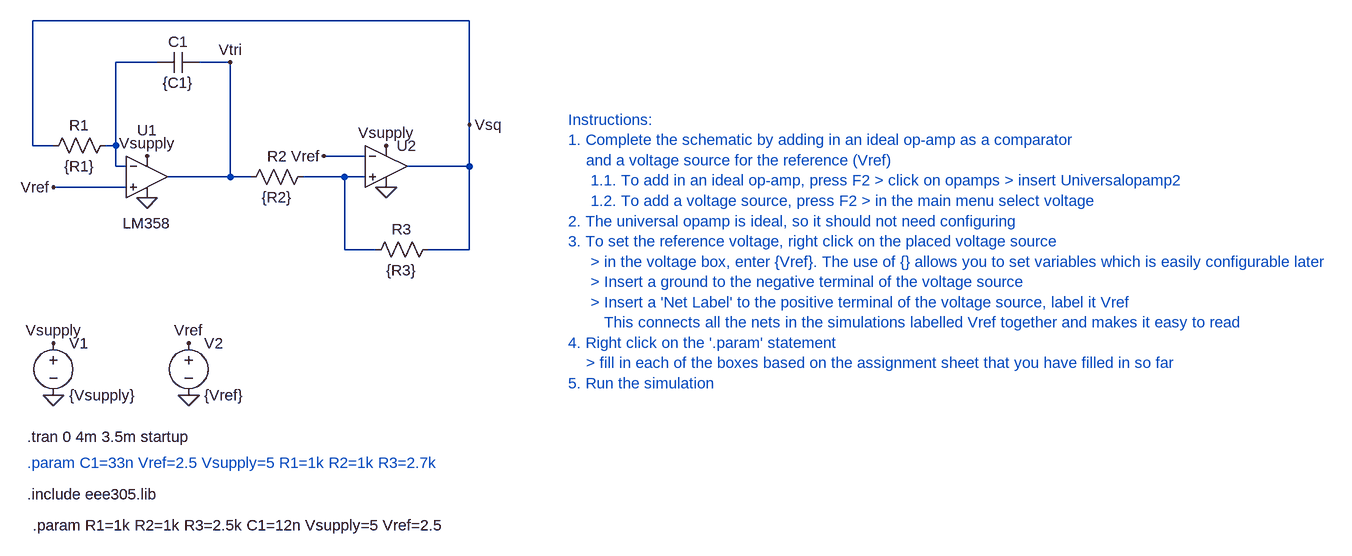
[diagram p0: schematic Assignment1_Task2_2.asc]
* Assignment1_Task2_2.asc
V1 Vsupply 0 {Vsupply}
R1 N001 Vsq {R1}
C1 Vtri N001 {C1} Rser=10m
R2 N002 Vtri {R2}
R3 Vsq N002 {R3}
XU2 N002 Vref Vsupply 0 Vsq level2 Avol=1Meg GBW=10Meg Slew=10000Meg Ilimit=25m Rail=0 Vos=0 En=0 Enk=0 In=0 Ink=0 Rin=500Meg  ; pins In+ In- V+ V- OUT
V2 Vref 0 {Vref}
* U1: LM358 (symbol AutoGenerated\LM358 not available, pins judged from their places): In+=Vref In-=N001 V+=Vsupply V-=0 OUT=Vtri
.tran 0 4m 3.5m startup
* .param C1=33n Vref=2.5 Vsupply=5 R1=1k R2=1k R3=2.7k
* Instructions:
* 1. Complete the schematic by adding in an ideal op-amp as a comparator
*     and a voltage source for the reference (Vref)
*      1.1. To add in an ideal op-amp, press F2 > click on opamps > insert Universalopamp2
*      1.2. To add a voltage source, press F2 > in the main menu select voltage
* 2. The universal opamp is ideal, so it should not need configuring
* 3. To set the reference voltage, right click on the placed voltage source
*      > in the voltage box, enter {Vref}. The use of {} allows you to set variables which is easily configurable later
*      > Insert a ground to the negative terminal of the voltage source
*      > Insert a 'Net Label' to the positive terminal of the voltage source, label it Vref
*         This connects all the nets in the simulations labelled Vref together and makes it easy to read
* 4. Right click on the '.param' statement
*     > fill in each of the boxes based on the assignment sheet that you have filled in so far
* 5. Run the simulation
.include eee305.lib
.param R1=1k R2=1k R3=2.5k C1=12n Vsupply=5 Vref=2.5
.lib UniversalOpAmp2.lib
.backanno
.end

* Results of the author's LTspice run, read from the files saved beside the schematic
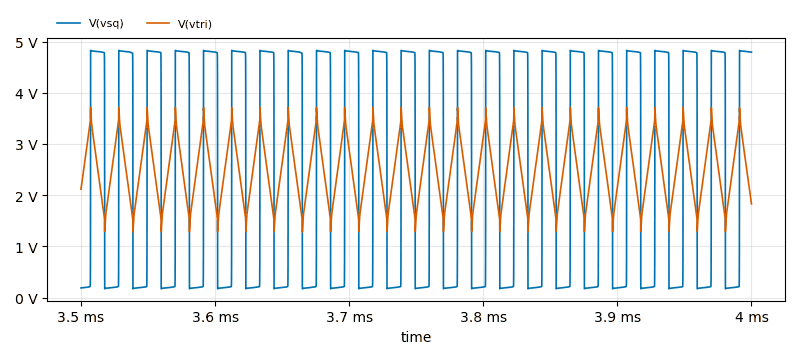
[diagram p1: Transient Analysis of Assignment1_Task2_2.asc, plotted from the saved traces]
* Transient Analysis, 1 run:
*   V(vsq): min 170.9 mV, max 4.829 V, average 2.508 V, rms 3.4 V, last 4.795 V
*   V(vtri): min 1.28 V, max 3.711 V, average 2.507 V, rms 2.583 V, last 1.829 V